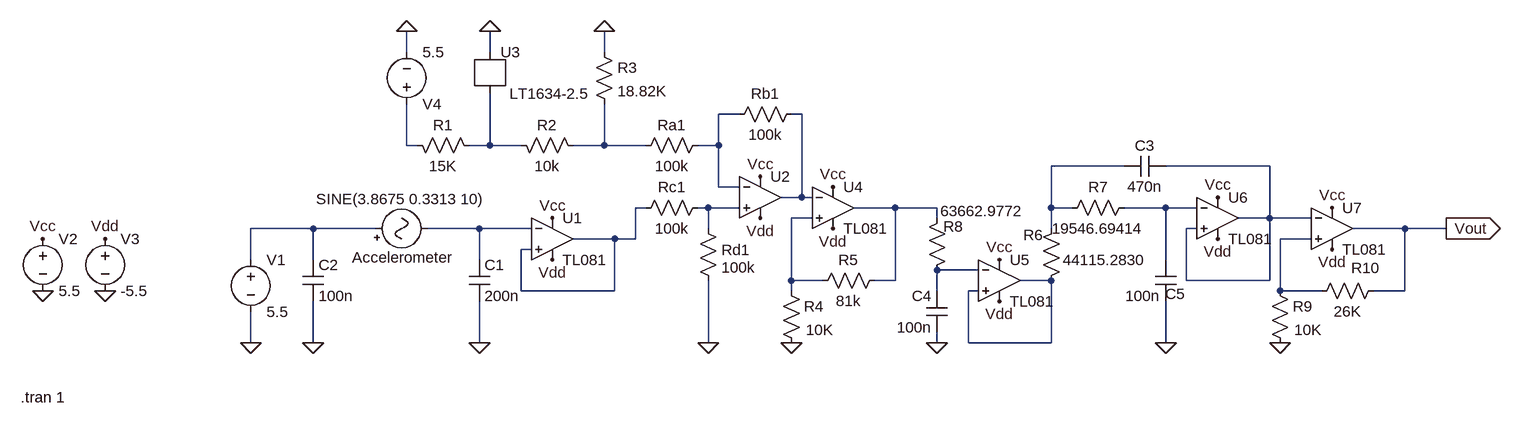
[diagram p0: schematic Samlet_system_Ny.asc]
Samlet_system_Ny.asc, the LTspice schematic file:
Version 4
SHEET 1 1624 692
WIRE -192 -240 -192 -272
WIRE -64 -240 -64 -272
WIRE 112 -240 112 -272
WIRE 320 -144 288 -144
WIRE 416 -144 400 -144
WIRE -192 -96 -192 -160
WIRE -176 -96 -192 -96
WIRE -64 -96 -64 -176
WIRE -64 -96 -96 -96
WIRE -16 -96 -64 -96
WIRE 112 -96 112 -160
WIRE 112 -96 64 -96
WIRE 176 -96 112 -96
WIRE 288 -96 288 -144
WIRE 288 -96 256 -96
WIRE 912 -64 800 -64
WIRE 1136 -64 976 -64
WIRE 288 -32 288 -96
WIRE 320 -32 288 -32
WIRE 416 -16 416 -144
WIRE 416 -16 384 -16
WIRE 432 -16 416 -16
WIRE 176 0 160 0
WIRE 272 0 256 0
WIRE 320 0 272 0
WIRE 560 0 496 0
WIRE 624 0 560 0
WIRE 800 0 800 -64
WIRE 832 0 800 0
WIRE 976 0 912 0
WIRE 1024 0 976 0
WIRE 432 16 400 16
WIRE 624 16 624 0
WIRE 1136 16 1136 -64
WIRE 1136 16 1088 16
WIRE 1200 16 1136 16
WIRE -336 32 -432 32
WIRE -240 32 -336 32
WIRE -80 32 -160 32
WIRE 0 32 -80 32
WIRE 272 32 272 0
WIRE 800 32 800 0
WIRE 1024 32 1008 32
WIRE 1344 32 1264 32
WIRE 1408 32 1344 32
WIRE 128 48 64 48
WIRE 160 48 160 0
WIRE 160 48 128 48
WIRE 1200 48 1152 48
WIRE 0 64 -16 64
WIRE -432 80 -432 32
WIRE -336 80 -336 32
WIRE -80 80 -80 32
WIRE 976 80 976 0
WIRE 688 96 624 96
WIRE 400 112 400 16
WIRE 448 112 400 112
WIRE 560 112 560 0
WIRE 560 112 528 112
WIRE 800 112 752 112
WIRE 1008 112 1008 32
WIRE 1136 112 1136 16
WIRE 1136 112 1008 112
WIRE -16 128 -16 64
WIRE 128 128 128 48
WIRE 128 128 -16 128
WIRE 400 128 400 112
WIRE 624 128 624 96
WIRE 688 128 672 128
WIRE 1152 128 1152 48
WIRE 1216 128 1152 128
WIRE 1344 128 1344 32
WIRE 1344 128 1296 128
WIRE -432 208 -432 160
WIRE -336 208 -336 144
WIRE -80 208 -80 144
WIRE 272 208 272 112
WIRE 624 208 624 192
WIRE 672 208 672 128
WIRE 800 208 800 112
WIRE 800 208 672 208
WIRE 976 208 976 144
FLAG -80 208 0
FLAG -336 208 0
FLAG -432 208 0
FLAG 32 16 Vcc
FLAG -656 128 0
FLAG -752 128 0
FLAG -752 48 Vcc
FLAG -656 48 Vdd
FLAG 32 80 Vdd
FLAG 352 -48 Vcc
FLAG 352 16 Vdd
FLAG 272 208 0
FLAG 112 -272 0
FLAG -64 -272 0
FLAG -192 -272 0
FLAG 400 208 0
FLAG 464 -32 Vcc
FLAG 464 32 Vdd
FLAG 1056 48 Vdd
FLAG 1056 -16 Vcc
FLAG 720 80 Vcc
FLAG 720 144 Vdd
FLAG 624 208 0
FLAG 976 208 0
FLAG 1408 32 Vout
IOPIN 1408 32 Out
FLAG 1152 208 0
FLAG 1232 0 Vcc
FLAG 1232 64 Vdd
SYMBOL Misc/signal -256 32 R270
WINDOW 0 -60 58 VTop 2
WINDOW 3 61 55 VBottom 2
WINDOW 123 0 0 Left 2
WINDOW 39 0 0 Left 2
SYMATTR InstName Accelerometer
SYMATTR Value SINE(3.8675 0.3313 10)
SYMBOL cap -96 80 R0
SYMATTR InstName C1
SYMATTR Value 200n
SYMBOL cap -352 80 R0
SYMATTR InstName C2
SYMATTR Value 100n
SYMBOL voltage -432 64 R0
SYMATTR InstName V1
SYMATTR Value 5.5
SYMBOL TL081 32 -16 R0
SYMATTR InstName U1
SYMBOL voltage -752 32 R0
SYMATTR InstName V2
SYMATTR Value 5.5
SYMBOL voltage -656 32 R0
SYMATTR InstName V3
SYMATTR Value -5.5
SYMBOL res 160 -80 R270
WINDOW 0 32 56 VTop 2
WINDOW 3 0 56 VBottom 2
SYMATTR InstName Ra1
SYMATTR Value 100k
SYMBOL res 304 -128 R270
WINDOW 0 32 56 VTop 2
WINDOW 3 0 56 VBottom 2
SYMATTR InstName Rb1
SYMATTR Value 100k
SYMBOL res 160 16 R270
WINDOW 0 32 56 VTop 2
WINDOW 3 0 56 VBottom 2
SYMATTR InstName Rc1
SYMATTR Value 100k
SYMBOL res 256 16 R0
WINDOW 0 36 49 Left 2
SYMATTR InstName Rd1
SYMATTR Value 100k
SYMBOL Opamps\\UniversalOpamp2 352 -16 R0
SYMATTR InstName U2
SYMBOL References\\LT1634-2.5 -64 -208 M180
WINDOW 0 16 32 Left 2
WINDOW 3 30 -32 Left 2
SYMATTR InstName U3
SYMBOL res -192 -112 M90
WINDOW 0 0 56 VBottom 2
WINDOW 3 32 56 VTop 2
SYMATTR InstName R1
SYMATTR Value 15K
SYMBOL res -32 -112 M90
WINDOW 0 0 56 VBottom 2
WINDOW 3 32 56 VTop 2
SYMATTR InstName R2
SYMATTR Value 10k
SYMBOL res 96 -256 R0
SYMATTR InstName R3
SYMATTR Value 18.82K
SYMBOL voltage -192 -144 M180
WINDOW 123 0 0 Left 2
WINDOW 39 0 0 Left 2
SYMATTR InstName V4
SYMATTR Value 5.5
SYMBOL res 384 112 R0
WINDOW 0 66 40 Right 2
WINDOW 3 81 76 Right 2
SYMATTR InstName R4
SYMATTR Value 10K
SYMBOL res 544 96 R90
WINDOW 0 0 56 VBottom 2
WINDOW 3 32 56 VTop 2
SYMATTR InstName R5
SYMATTR Value 81k
SYMBOL Opamps\\TL081 464 -64 R0
WINDOW 3 85 96 Right 2
SYMATTR InstName U4
SYMBOL res 784 128 M180
WINDOW 0 -27 86 Left 2
WINDOW 3 34 48 Left 2
SYMATTR InstName R6
SYMATTR Value 44115.2830
SYMBOL res 928 -16 R90
WINDOW 0 0 56 VBottom 2
WINDOW 3 32 56 VTop 2
SYMATTR InstName R7
SYMATTR Value 19546.69414
SYMBOL cap 976 -80 R90
WINDOW 0 0 32 VBottom 2
WINDOW 3 32 32 VTop 2
SYMATTR InstName C3
SYMATTR Value 470n
SYMBOL cap 640 128 M0
SYMATTR InstName C4
SYMATTR Value 100n
SYMBOL res 608 112 M180
WINDOW 0 26 83 Left 2
WINDOW 3 21 107 Left 2
SYMATTR InstName R8
SYMATTR Value 63662.9772
SYMBOL cap 992 144 R180
WINDOW 0 -14 11 Left 2
WINDOW 3 24 8 Left 2
SYMATTR InstName C5
SYMATTR Value 100n
SYMBOL TL081 720 48 R0
SYMATTR InstName U5
SYMBOL TL081 1056 -48 R0
SYMATTR InstName U6
SYMBOL res 1136 112 R0
WINDOW 0 66 40 Right 2
WINDOW 3 81 76 Right 2
SYMATTR InstName R9
SYMATTR Value 10K
SYMBOL res 1312 112 R90
WINDOW 0 -4 28 VBottom 2
WINDOW 3 32 56 VTop 2
SYMATTR InstName R10
SYMATTR Value 26K
SYMBOL Opamps\\TL081 1232 -32 R0
WINDOW 3 85 96 Right 2
SYMATTR InstName U7
TEXT -786 292 Left 2 !.tran 1

The netlist it stands for:
* Samlet_system_Ny.asc
V§Accelerometer N013 N014 SINE(3.8675 0.3313 10)
C1 N014 0 200n
C2 N013 0 100n
V1 N013 0 5.5
* U1: TL081 (symbol TL081 not available, pins judged from their places): In+=N008 In-=N014 V+=Vcc V-=Vdd OUT=N008
V2 Vcc 0 5.5
V3 Vdd 0 -5.5
Ra1 N005 N001 100k
Rb1 N001 N002 100k
Rc1 N008 N009 100k
Rd1 N009 0 100k
XU2 N009 N001 Vcc Vdd N002 level.2 Avol=1Meg GBW=10Meg Slew=10Meg ilimit=25m rail=0 Vos=0 phimargin=45 en=0 enk=0 in=0 ink=0 Rin=500Meg  ; pins IN+ IN- V+ V- OUT
XU3 N004 0 LT1634-2.5
R1 N003 N004 15K
R2 N004 N005 10k
R3 0 N005 18.82K
V4 N003 0 5.5
R4 N012 0 10K
R5 N010 N012 81k
XU4 N012 N002 Vcc Vdd N010 TL081  ; pins In+ In- V+ V- OUT
R6 N017 N006 44115.2830
R7 N011 N006 19546.69414
C3 N007 N006 470n
C4 N016 0 100n
R8 N016 N010 63662.9772
C5 0 N011 100n
* U5: TL081 (symbol TL081 not available, pins judged from their places): In+=N017 In-=N016 V+=Vcc V-=Vdd OUT=N017
* U6: TL081 (symbol TL081 not available, pins judged from their places): In+=N007 In-=N011 V+=Vcc V-=Vdd OUT=N007
R9 N015 0 10K
R10 Vout N015 26K
XU7 N015 N007 Vcc Vdd Vout TL081  ; pins In+ In- V+ V- OUT
.tran 1
.lib UniversalOpamps2.sub
.backanno
.end